# EAGLE design lcd (EAGLE 8.1.1)
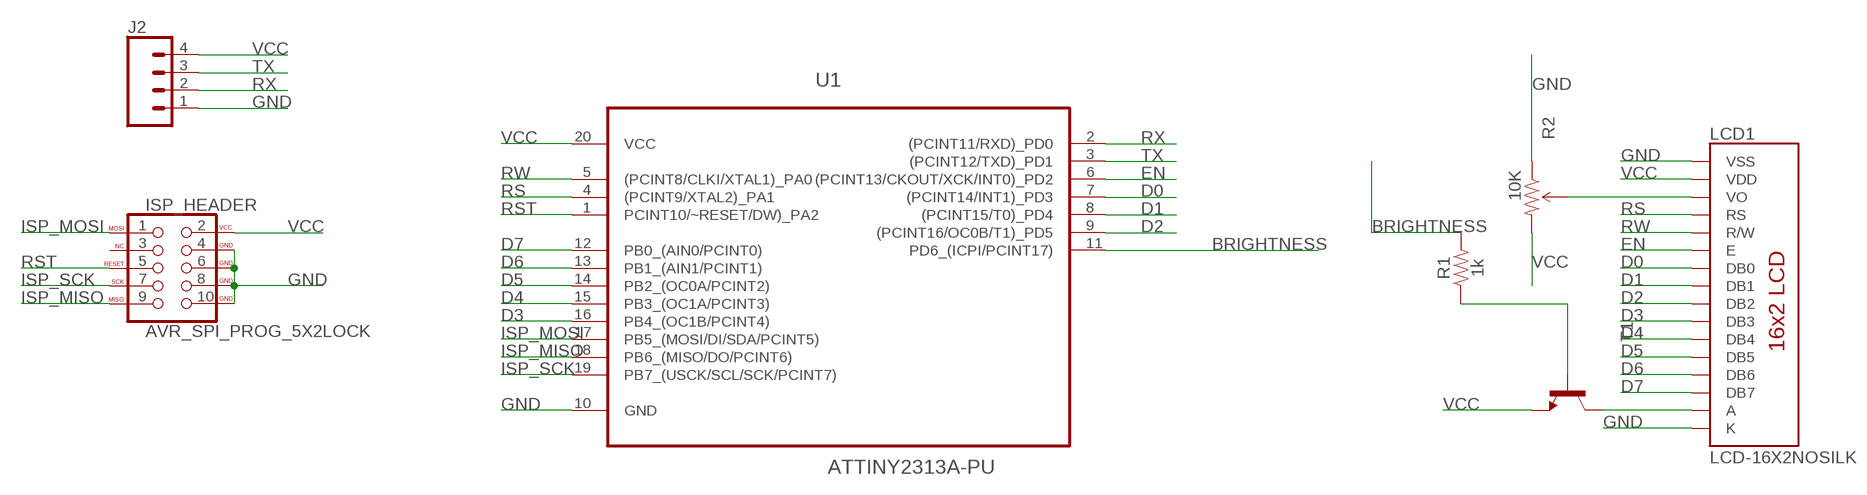
[diagram p0: schematic, sheet 1]

## Parts
ISP_HEADER  AVR_SPI_PROG_5X2LOCK  [2X5-SHROUDED_LOCK]
J2  CONN_04  [1X04]
LCD1  LCD-16X2NOSILK  [LCD-16X2_NOSILK]
R1  1k  1KOHM-HORIZ-1/4W-5%  [AXIAL-0.3]
R2  10K  TRIMPOTPTH  [TRIM_POT_PTH]
T1  -NPN-TO92-ECB  [TO92-ECB]
U1  ATTINY2313A-PU  [DIP254P762X533-20]

## Nets
BRIGHTNESS: R1.P$2 U1.11(PD6_(ICPI/PCINT17))
CONTRAST: LCD1.3(VO) R2.2(WIPER)
D0: LCD1.7(DB0) U1.7((PCINT14/INT1)_PD3)
D1: LCD1.8(DB1) U1.8((PCINT15/T0)_PD4)
D2: LCD1.9(DB2) U1.9((PCINT16/OC0B/T1)_PD5)
D3: LCD1.10(DB3) U1.16(PB4_(OC1B/PCINT4))
D4: LCD1.11(DB4) U1.15(PB3_(OC1A/PCINT3))
D5: LCD1.12(DB5) U1.14(PB2_(OC0A/PCINT2))
D6: LCD1.13(DB6) U1.13(PB1_(AIN1/PCINT1))
D7: LCD1.14(DB7) U1.12(PB0_(AIN0/PCINT0))
EN: LCD1.6(E) U1.6((PCINT13/CKOUT/XCK/INT0)_PD2)
GND: ISP_HEADER.4(GND) ISP_HEADER.6(GND) ISP_HEADER.8(GND) ISP_HEADER.10(GND) J2.1 LCD1.1(VSS) LCD1.16(K) R2.1(CCW) U1.10(GND)
ISP_MISO: ISP_HEADER.9(MISO) U1.18(PB6_(MISO/DO/PCINT6))
ISP_MOSI: ISP_HEADER.1(MOSI) U1.17(PB5_(MOSI/DI/SDA/PCINT5))
ISP_SCK: ISP_HEADER.7(SCK) U1.19(PB7_(USCK/SCL/SCK/PCINT7))
N$1: LCD1.15(A) T1.C
N$2: R1.P$1 T1.B
RS: LCD1.4(RS) U1.4((PCINT9/XTAL2)_PA1)
RST: ISP_HEADER.5(RESET) U1.1(PCINT10/~RESET/DW)_PA2)
RW: LCD1.5(R/W) U1.5((PCINT8/CLKI/XTAL1)_PA0)
RX: J2.2 U1.2((PCINT11/RXD)_PD0)
TX: J2.3 U1.3((PCINT12/TXD)_PD1)
VCC: ISP_HEADER.2(VCC) J2.4 LCD1.2(VDD) R2.3(CW) T1.E U1.20(VCC)
Unconnected: ISP_HEADER.3(NC)

## Library data of the parts
ISP_HEADER = SparkFun-Connectors:AVR_SPI_PROG_5X2: AVR 10-pin ICSP Header This is the standard AVR In Circuit Serial Programming header. Minimal, but includes pin one indicator. Works with standard Olimex programmers. SparkFun Products: 2x5 AVR ICSP Male Header <https://www.sparkfun.com/products/778> - PTH 2x5 Pin Shrouded Header <https://www.sparkfun.com/products/8506> - PTH2; PROD_ID: CONN-08671; SF_ID: PRT-08506
J2 = SparkFun-Connectors:CONN_04: Multi connection point. Often used as Generic Header-pin footprint for 0.1 inch spaced/style header connections On any of the 0.1 inch spaced packages, you can populate with these: Break Away Headers - Straight <https://www.sparkfun.com/products/116> (PRT-00116) Break Away Male Headers - Right Angle <https://www.sparkfun.com/products/553> (PRT-00553) Female Headers <https://www.sparkfun.com/products/115> (PRT-00115) Break Away Headers - Machine Pin <https://www.sparkfun.com/products/117> (PRT-00117) Break Away Female Headers - Swiss Machine Pin <https://www.sparkfun.com/products/743> (PRT-00743) For SCREWTERMINALS and SPRING TERMINALS visit here: Screw Terimnals on SparkFun.com <https://www.sparkfun.com/search/results?term=Screw+Terminals> (5mm/3.5mm/2.54mm spacing) This device is also useful as a general connection point to wire up your design to another part of your project. Our various solder wires solder well into these plated through hole pads. Hook-Up Wire - Assortment (Stranded, 22 AWG) <https://www.sparkfun.com/products/11375> (PRT-11375) Hook-Up Wire - Assortment (Solid Core, 22 AWG) <https://www.sparkfun.com/products/11367> (PRT-11367) View the entire wire category on our website here <https://www.sparkfun.com/categories/141> Special notes: Molex polarized connector foot print use with SKU : PRT-08231 with associated crimp pins and housings. 1MM SMD Version SKU: PRT-10208; PROD_ID: CONN-09696
LCD1 = SparkFun-Displays:LCD-16X2: Standard text-only 16x2 parallel input LCD Basic 16 character by 2 line display. Typically utilizes the extremely common HD44780 parallel interface chipset SparkFun Products: Basic 16x2 Green <https://www.sparkfun.com/products/255> Basic 8x2 Green <https://www.sparkfun.com/products/11122>; SF_ID: LCD-00255
R1 = SparkFun-Resistors:1KOHM: 1kΩ resistor A resistor is a passive two-terminal electrical component that implements electrical resistance as a circuit element. Resistors act to reduce current flow, and, at the same time, act to lower voltage levels within circuits. - Wikipedia; PROD_ID: RES-08380
R2 = SparkFun-Retired:TRIMPOT: Various small potentiometers for "set-and-forget" applications; PROD_ID: RES-08445
T1 = transistor:*-NPN-: NPN Transistror BF959 corrected 2008.03.06
U1 = Atmel_By_element14_Batch_1-00:ATTINY2313A-PU: 8-bit Microcontroller; DESCRIPTION: 8-bit Microcontroller; MPN: ATTINY2313A-PU; OC_FARNELL: 1841616; OC_NEWARK: 12T1333; PACKAGE: DIP-20; SUPPLIER: Atmel

## Board
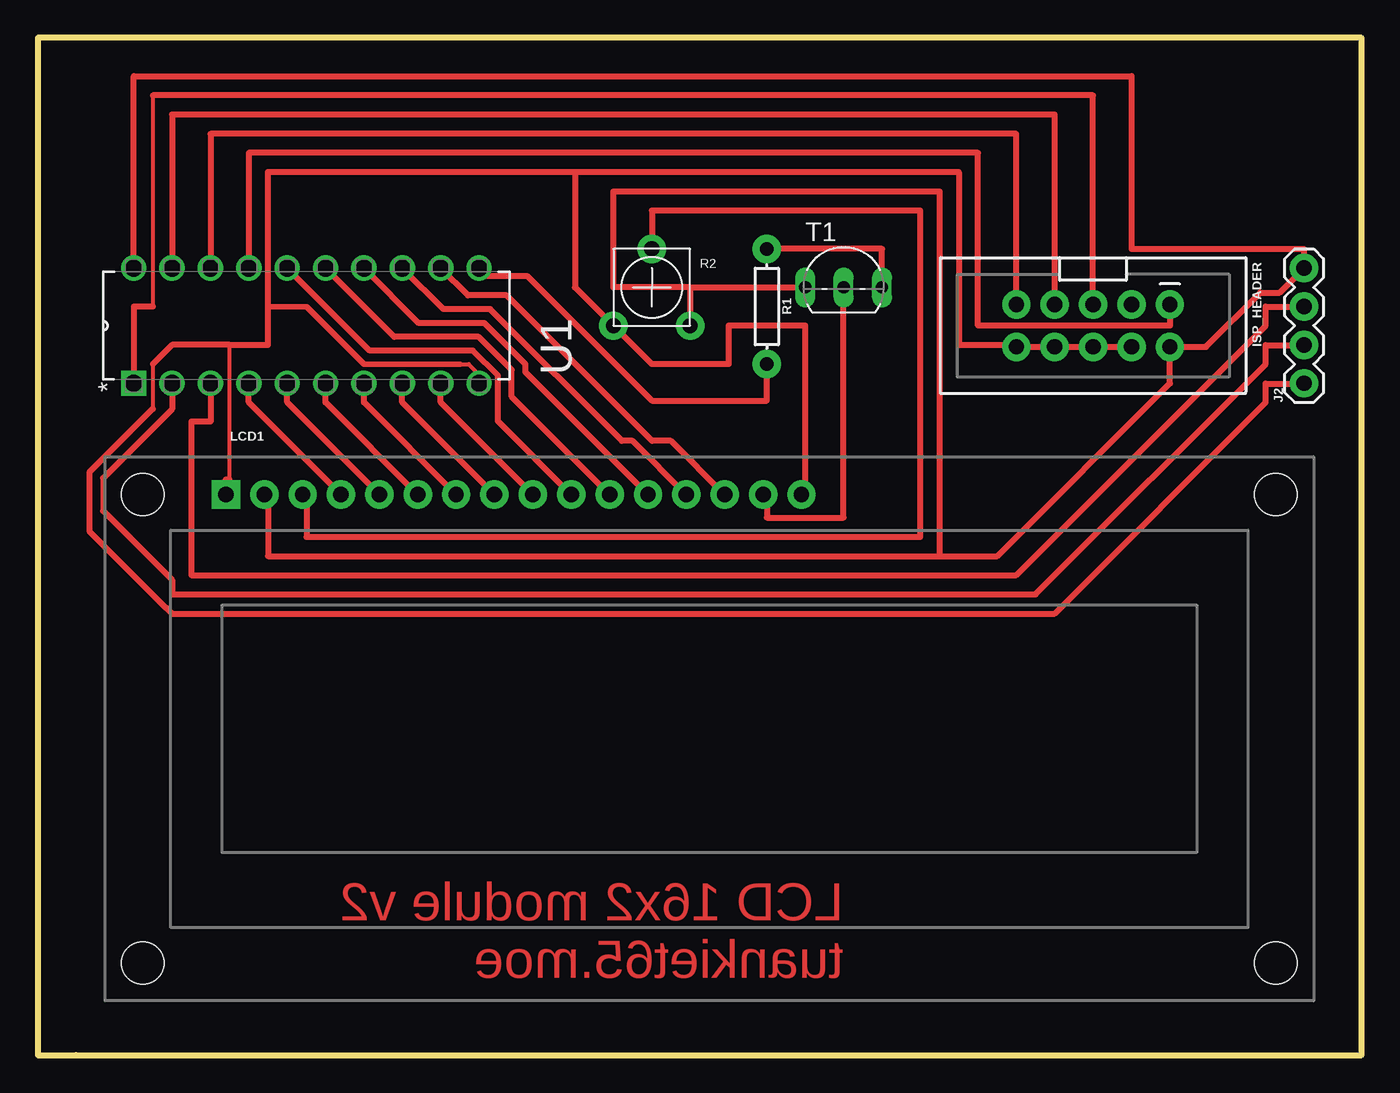
[diagram p1: board, top side]
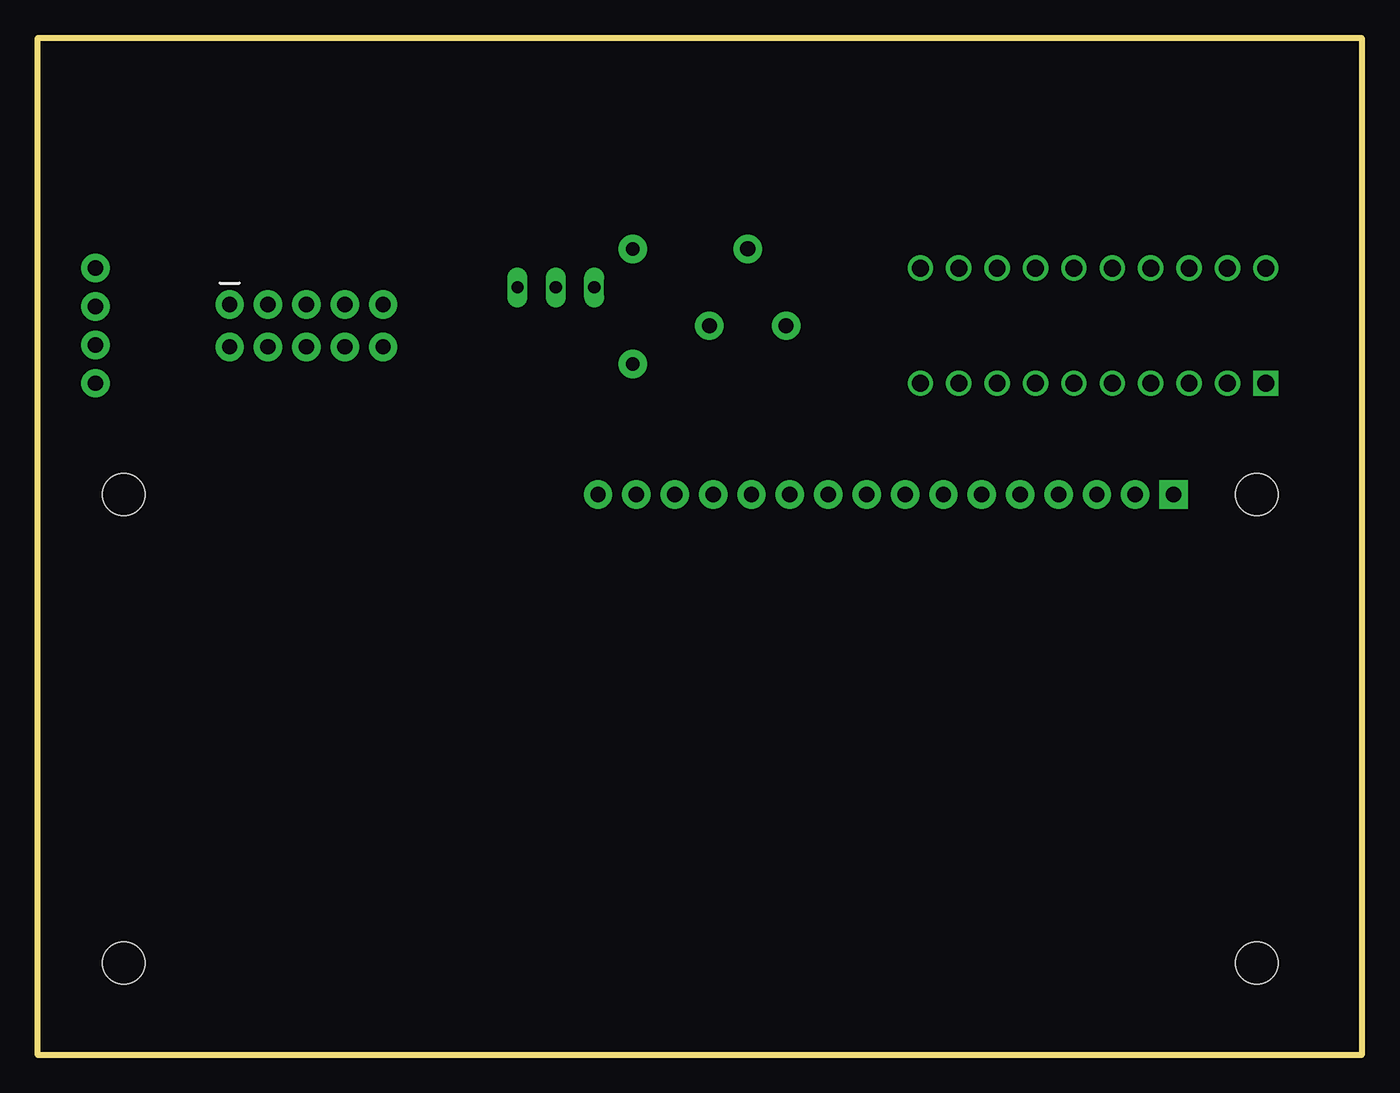
[diagram p2: board, bottom side, seen from below]

Size 87.63 x 67.31 mm. Coordinates in mm from the lower left corner, seen from the top.
Outline: 1.27,0 2.54,0
Outline: 2.54,0 0,0 0,67.31 87.63,67.31 87.63,0 2.54,0
Copper layers (1*16): Top 0.035mm / dielectric 1.5mm / Bottom 0.035mm
Design rules "default *": minimum track width 16mil, minimum drill 24mil, track to track 20mil, track to pad 8mil, pad to pad 8mil, via to via 8mil, smd to smd 8mil, copper to edge 40mil, drill to drill 8mil, minimum pad ring 10mil, minimum via ring 8mil, stop-mask expansion 4mil, vias tented up to drill 0mil, thermal gap 10mil

### Footprints (pad centres in the part's own frame; a part is rotated, then mirrored left to right if it is on the bottom)
2X5-SHROUDED_LOCK = drill 1.016 pad 1.88: 1 -1.397,5.08; 2 1.397,5.08; 3 -1.397,2.54; 4 1.397,2.54; 5 -1.397,0; 6 1.397,0; 7 -1.397,-2.54; 8 1.397,-2.54; 9 -1.397,-5.08; 10 1.397,-5.08
1X04 = drill 1.016 pad 1.88: 1 0,0; 2 2.54,0; 3 5.08,0; 4 7.62,0
LCD-16X2_NOSILK = drill 1.016 pad 1.88 square: 1 -32,15.5 | drill 1.016 pad 1.88: 2 -29.46,15.5; 3 -26.92,15.5; 4 -24.38,15.5; 5 -21.84,15.5; 6 -19.3,15.5; 7 -16.76,15.5; 8 -14.22,15.5; 9 -11.68,15.5; 10 -9.14,15.5; 11 -6.6,15.5; 12 -4.06,15.5; 13 -1.52,15.5; 14 1.02,15.5; 15 3.56,15.5; 16 6.1,15.5 | hole 2.8: -37.5,15.5; -37.5,-15.5; 37.5,15.5; 37.5,-15.5
AXIAL-0.3 = drill 0.9 pad 1.88: P$1 -3.81,0; P$2 3.81,0
TRIM_POT_PTH = drill 1 pad 1.88: 1 -2.54,-2.54; 2 0,2.54; 3 2.54,-2.54
TO92-ECB = drill 0.813 long: B 2.54,0; C 0,0; E -2.54,0
DIP254P762X533-20 = drill 1.118 square: 1 -7.62,22.86 | drill 1.118: 2 -7.62,20.32; 3 -7.62,17.78; 4 -7.62,15.24; 5 -7.62,12.7; 6 -7.62,10.16; 7 -7.62,7.62; 8 -7.62,5.08; 9 -7.62,2.54; 10 -7.62,0; 11 0,0; 12 0,2.54; 13 0,5.08; 14 0,7.62; 15 0,10.16; 16 0,12.7; 17 0,15.24; 18 0,17.78; 19 0,20.32; 20 0,22.86

### Placement (x,y rotation side)
ISP_HEADER  69.85,48.26 270 top
J2  83.82,44.45 90 top
LCD1  44.45,21.59 0 top
R1  48.26,49.53 270 top
R2  40.64,50.8 0 top
T1  53.34,50.8 0 top
U1  29.21,52.07 90 top

### Tracks (layer width: path | path; a pad name or v marks a point on that pad's centre or on a via)
BRIGHTNESS
  Top 0.406: U1.11 29.72,51.56 32.37,51.56 40.64,43.3 48.26,43.3 R1.P$2
CONTRAST
  Top 0.406: LCD1.3 17.78,37.09 17.78,34.29 58.42,34.29 58.42,55.88 40.64,55.88 R2.2
D0
  Top 0.406: LCD1.7 21.59,43.19 U1.7
D1
  Top 0.406: LCD1.8 24.13,43.19 U1.8
D2
  Top 0.406: LCD1.9 26.67,43.19 U1.9
D3
  Top 0.406: U1.16 21.97,46.61 28.81,46.61 30.46,44.97 30.46,41.95 LCD1.10
D4
  Top 0.406: LCD1.11 31.37,43.56 31.37,45.34 29.19,47.52 23.6,47.52 U1.15
D5
  Top 0.406: LCD1.12 32.28,45.19 32.28,45.72 29.57,48.44 25.22,48.44 U1.14
D6
  Top 0.406: LCD1.13 39.37,40.64 38.66,40.64 29.95,49.35 26.85,49.35 U1.13
D7
  Top 0.406: LCD1.14 41.91,40.64 40.66,40.64 31.04,50.27 28.47,50.27 U1.12
EN
  Top 0.406: LCD1.6 19.05,43.19 U1.6
GND
  Top 0.254: 7.62,45.72 7.62,42.76 | 12.7,38.1 12.7,46.99 | 27.94,45.72 28.51,45.72 29.21,45.03 U1.10
  Top 0.356: 15.24,49.53 17.79,49.53 21.6,45.72 27.94,45.72
  Top 0.406: 7.62,45.72 8.89,46.99 12.7,46.99 15.24,46.99 15.24,49.53 15.24,58.42 35.56,58.42 | J2.1 83.82,44.43 81.28,44.43 81.28,43.18 67.31,29.21 8.89,29.21 8.53,29.57 8.51,29.57 3.42,34.66 3.42,38.55 7.62,42.76 | LCD1.16 50.8,37.09 50.8,48.26 45.72,48.26 45.72,45.72 40.64,45.72 R2.1 35.56,50.8 35.56,58.42 | 35.56,58.42 60.96,58.42 60.96,46.99 64.77,46.99 ISP_HEADER.10 ISP_HEADER.8 ISP_HEADER.6 ISP_HEADER.4 | 12.7,38.1 12.45,38.1 LCD1.1
ISP_MISO
  Top 0.406: ISP_HEADER.9 64.77,60.96 11.43,60.96 U1.18
ISP_MOSI
  Top 0.406: ISP_HEADER.1 74.93,48.26 62.23,48.26 62.23,59.69 13.97,59.69 U1.17
ISP_SCK
  Top 0.406: ISP_HEADER.7 67.31,62.23 8.89,62.23 U1.19
N$1
  Top 0.406: LCD1.15 48.26,37.09 48.26,35.56 53.34,35.56 T1.C
N$2
  Top 0.406: T1.B 55.88,53.34 R1.P$1
RS
  Top 0.406: LCD1.4 13.97,43.19 U1.4
RST
  Top 0.254: 7.62,63.5 7.62,49.53
  Top 0.406: ISP_HEADER.5 69.85,63.5 7.62,63.5 | 7.62,49.53 6.35,49.53 U1.1
RW
  Top 0.406: LCD1.5 16.51,43.19 U1.5
RX
  Top 0.406: 83.82,46.97 J2.2 83.82,46.97 | U1.2 8.89,42.73 4.33,38.17 4.33,36 8.89,31.45 8.89,30.48 66.04,30.48 81.28,45.72 81.28,46.97 83.82,46.97
TX
  Top 0.406: U1.3 11.43,41.91 10.16,41.91 10.16,31.75 64.77,31.75 81.28,48.26 81.28,49.53 J2.3
VCC
  Top 0.406: LCD1.2 15.24,37.09 15.24,33.02 59.69,33.02 | 43.18,50.8 38.1,50.8 38.1,57.15 59.69,57.15 59.69,33.02 | 43.18,50.8 R2.3 | 43.18,50.8 T1.E | U1.20 6.35,64.77 72.39,64.77 72.39,53.34 83.82,53.34 J2.4 82.19,50.44 80.9,50.44 77.32,46.86 ISP_HEADER.2 74.93,44.45 63.5,33.02 59.69,33.02

### Text on the board
Top: LCD 16x2 module v2 / tuankiet65.moe